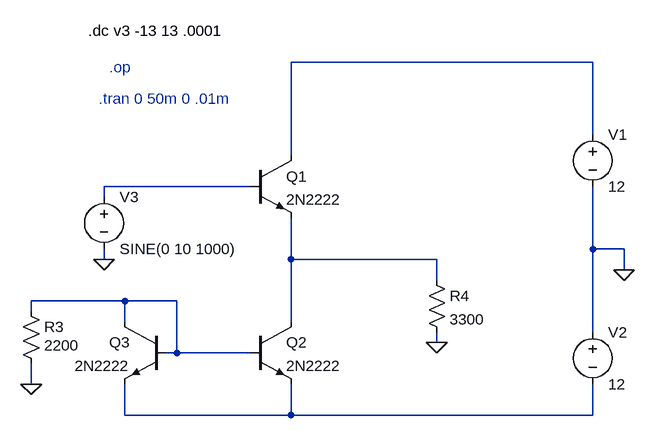
[diagram p0: schematic teoria1.asc]
teoria1.asc, the LTspice schematic file:
Version 4
SHEET 1 880 680
WIRE 736 -64 272 -64
WIRE 736 48 736 -64
WIRE 272 80 272 -64
WIRE 208 128 -16 128
WIRE -16 144 -16 128
WIRE 736 224 736 128
WIRE 784 224 736 224
WIRE -16 240 -16 224
WIRE 272 240 272 176
WIRE 496 240 272 240
WIRE 784 256 784 224
WIRE 496 272 496 240
WIRE 16 304 -128 304
WIRE 96 304 16 304
WIRE -128 320 -128 304
WIRE 16 336 16 304
WIRE 272 336 272 240
WIRE 736 352 736 224
WIRE 496 368 496 352
WIRE 96 384 96 304
WIRE 96 384 80 384
WIRE 208 384 96 384
WIRE -128 432 -128 400
WIRE 16 480 16 432
WIRE 272 480 272 432
WIRE 272 480 16 480
WIRE 736 480 736 432
WIRE 736 480 272 480
FLAG 784 256 0
FLAG -128 432 0
FLAG 496 368 0
FLAG -16 240 0
DATAFLAG 384 240 ""
DATAFLAG 384 240 ""
DATAFLAG 160 128 ""
DATAFLAG 160 128 ""
SYMBOL npn 208 80 R0
SYMATTR InstName Q1
SYMATTR Value 2N2222
SYMBOL npn 208 336 R0
SYMATTR InstName Q2
SYMATTR Value 2N2222
SYMBOL npn 80 336 M0
SYMATTR InstName Q3
SYMATTR Value 2N2222
SYMBOL voltage 736 32 R0
WINDOW 123 0 0 Left 0
WINDOW 39 0 0 Left 0
SYMATTR InstName V1
SYMATTR Value 12
SYMBOL voltage 736 336 R0
WINDOW 123 0 0 Left 0
WINDOW 39 0 0 Left 0
SYMATTR InstName V2
SYMATTR Value 12
SYMBOL res -144 304 R0
WINDOW 3 36 68 Left 2
SYMATTR Value 2200
SYMATTR InstName R3
SYMBOL res 480 256 R0
SYMATTR InstName R4
SYMATTR Value 3300
SYMBOL voltage -16 128 R0
WINDOW 123 0 0 Left 0
WINDOW 39 0 0 Left 0
SYMATTR InstName V3
SYMATTR Value SINE(0 10 1000)
TEXT -8 -56 Left 2 ;.op
TEXT -24 -8 Left 2 ;.tran 0 50m 0 .01m
TEXT -40 -112 Left 2 !.dc v3 -13 13 .0001

The netlist it stands for:
* teoria1.asc
Q1 N001 N002 N003 0 2N2222
Q2 N003 N004 N005 0 2N2222
Q3 N004 N004 N005 0 2N2222
V1 N001 0 12
V2 0 N005 12
R3 N004 0 2200
R4 N003 0 3300
V3 N002 0 SINE(0 10 1000)
.model NPN NPN
.model PNP PNP
.lib standard.bjt
* .op
* .tran 0 50m 0 .01m
.dc v3 -13 13 .0001
.backanno
.end